# EasyEDA Pro project 密码存储器.eprj, board PCB2
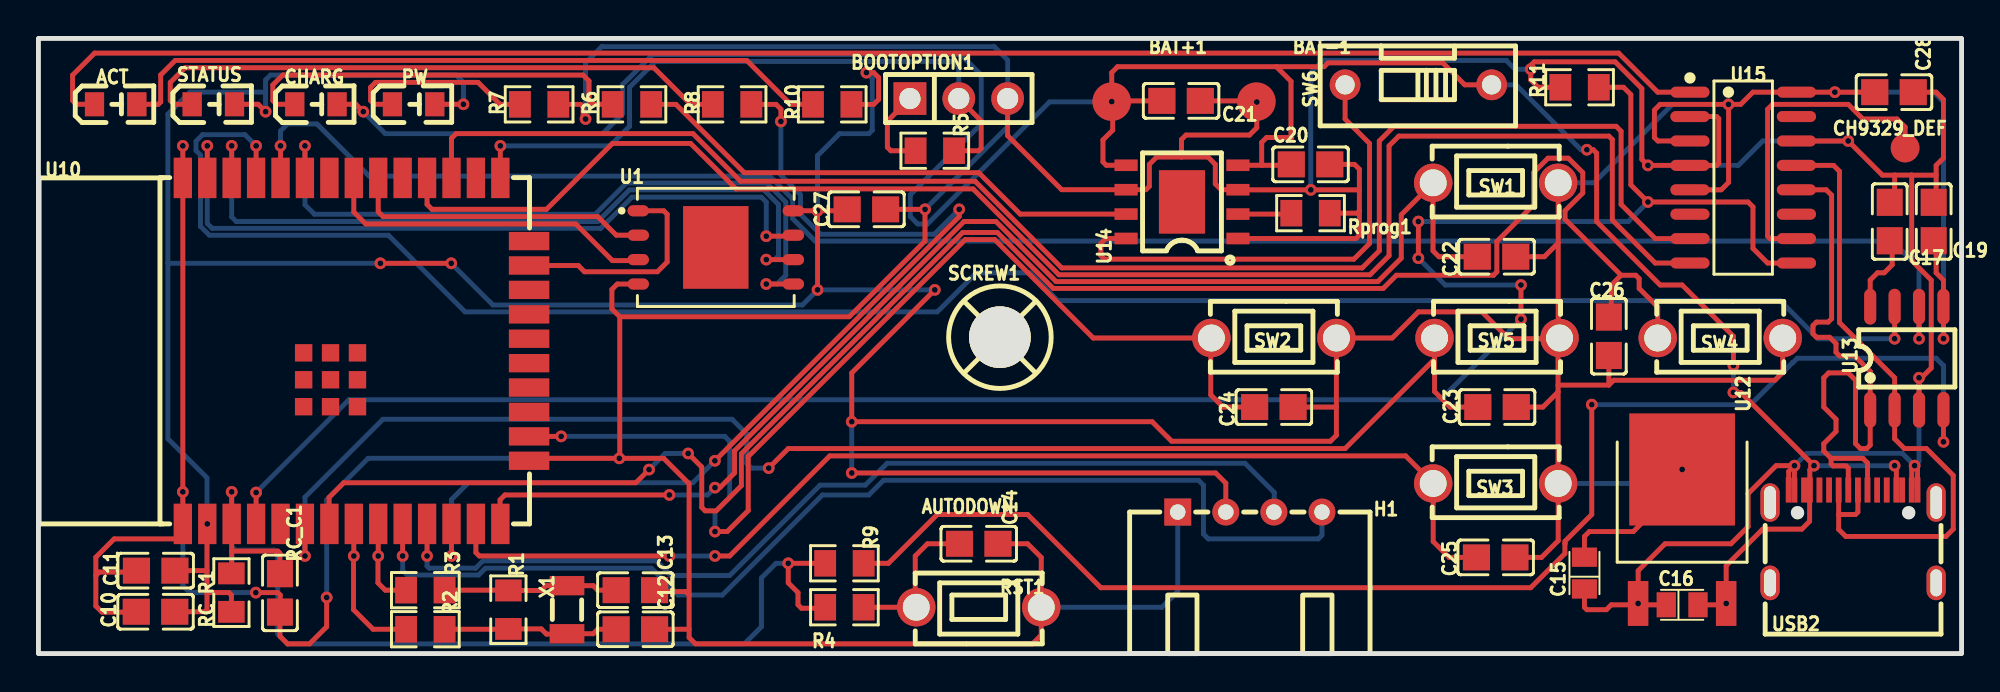
[diagram p4: board, top side]
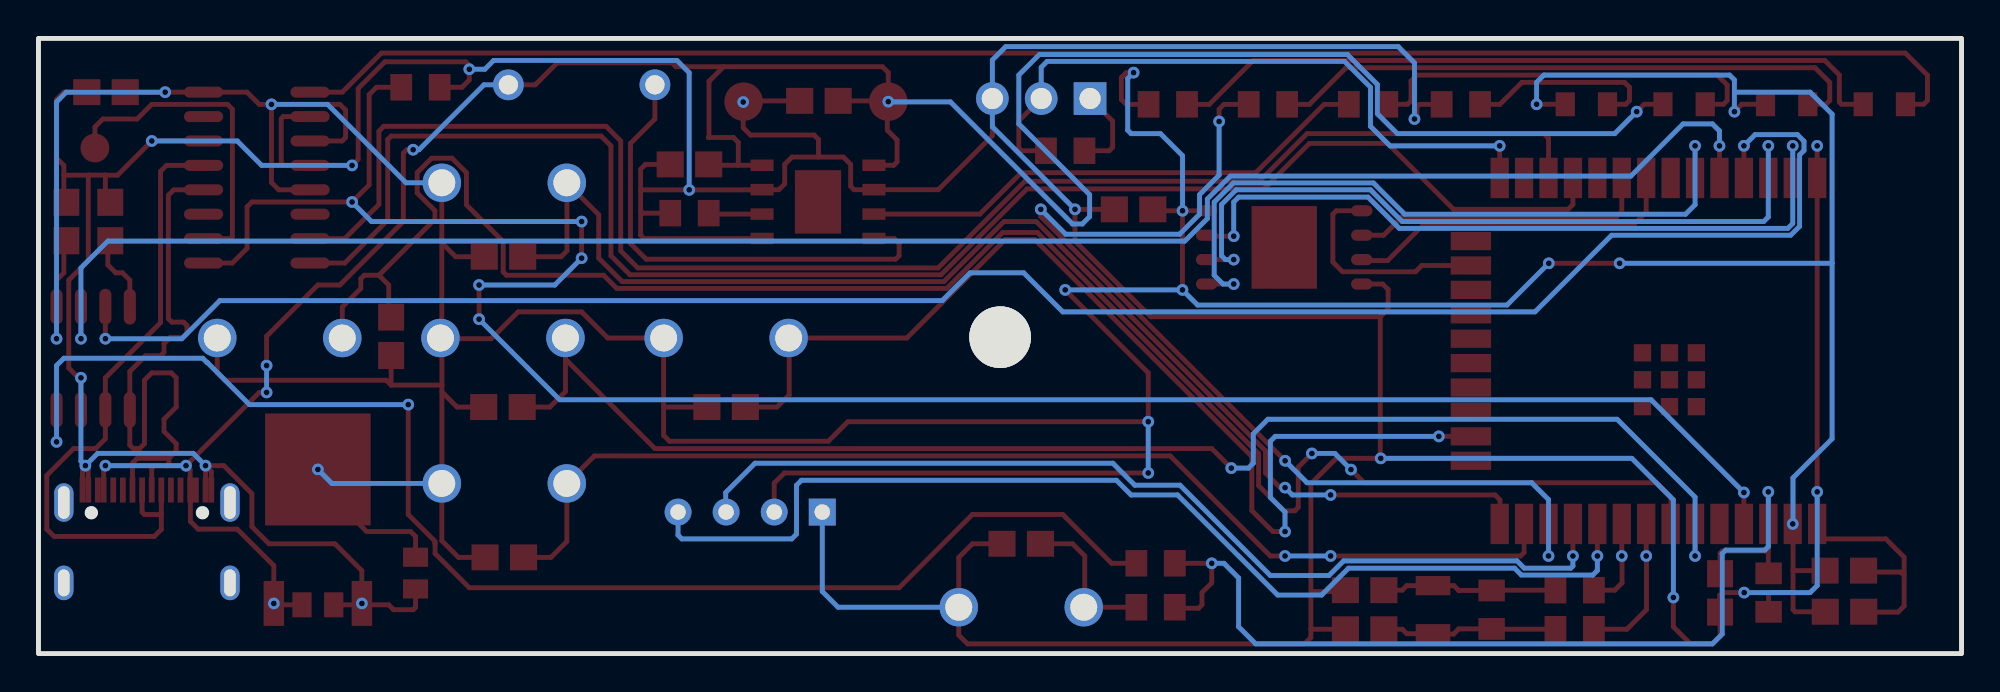
[diagram p5: board, bottom side, seen from below]

Outline 100 x 32 mm; copper layers: Top Layer, Bottom Layer. Coordinates in mm from the lower left corner of the outline.
Outline path: rectangle 0,32 100,0
Stack: Top Layer 0.035mm / Dielectric1 1.51mm FR4 er 4.5 / Bottom Layer 0.035mm

## Design rules (mm)
net UD+: DP1
net UD-: DP1
template: JLCPCB Capability(Two Layers Board)
spacing copperThickness1oz (default): track to track 0.102, other pairs 0.152 to 0.3
spacing copperThickness2oz: track to track 0.203, other pairs 0.152 to 0.3
track width copperThickness1oz (default): min 0.127, default 0.254, max 2.54
track width copperThickness2oz: min 0.203, default 0.254, max 2.54
differential pair differentialPair (default): width min 0.127, default 0.254, max 2.54; gap min 0.152, default 0.152
via viaSize (default): diameter min 0.5, default 0.61, max 10; hole min 0.3, default 0.305, max 6.3

## Placement (name value [footprint] x y rotation side)
ACT  -  [LED_0805]  4.06 28.57 0 top
BAT+1  -  [Test-Point-0.5mm]  55.81 28.71 90 top
BAT-1  -  [Test-Point-0.5mm]  63.33 28.71 90 top
BOOTOPTION1  PZ254V-11-03P  [HDR-TH_3P-P2.54-V-M]  47.86 28.87 0 top
C10  0.1uf  [C0805]  6.09 2.17 0 top
C11  22uf  [C0805]  6.1 4.31 0 top
C12  12pf  [C0805]  31.04 1.27 180 top
C13  12pf  [C0805]  31.04 3.3 180 top
C14  0.1uf  [C0805]  48.9 5.71 180 top
C15  10uF  [CAP-SMD_L2.1-W1.4-FD]  80.39 4.19 90 top
C16  22uF  [CAP-SMD_L2.1-W1.4-FD]  85.47 2.54 0 top
C17  0.1uf  [C0805]  96.27 22.47 90 top
C19  0.1uf  [C0805]  98.55 22.47 90 top
C20  10uf  [C0805]  66.15 25.45 0 top
C21  10uf  [C0805]  59.42 28.75 180 top
C22  0.1uf  [C0805]  75.82 20.64 0 top
C23  0.1uf  [C0805]  75.85 12.82 0 top
C24  0.1uf  [C0805]  64.24 12.82 0 top
C25  0.1uf  [C0805]  75.78 5 0 top
C26  0.1uf  [C0805]  81.66 16.51 270 top
C27  0.1uf  [C0805]  43.05 23.11 180 top
C28  0.1uf  [C0805]  96.49 29.21 180 top
CH9329_DEF  -  [Test-Point-0.5mm#2]  97.06 26.3 0 top
CHARG  -  [LED_0805]  14.48 28.57 0 top
H1  HCZZ0139-4  [CONN-TH_4P-P2.50_HCZZ0139-4]  62.99 7.36 0 top
PW  -  [LED_0805]  19.56 28.57 0 top
R1  7.5M  [R0805]  24.44 2.28 270 top
R2  0  [R0805]  20.12 1.27 180 top
R3  0  [R0805]  20.12 3.3 180 top
R4  0  [R0805]  41.91 2.41 180 top
R5  0  [R0805]  46.61 26.16 180 top
R6  10K  [R0805]  30.86 28.57 0 top
R7  10K  [R0805]  26.03 28.57 0 top
R8  10K  [R0805]  36.07 28.57 0 top
R9  0  [R0805]  41.91 4.7 0 top
R10  3.3K  [R0805]  41.28 28.57 180 top
R11  4.7K  [R0805]  80.14 29.46 0 top
RC_C1  1uf  [C0805]  12.56 3.16 90 top
RC_R1  10K  [R0805]  10.03 3.17 270 top
Rprog1  10K  [R0805]  66.15 22.91 180 top
RST1  ZX-QC36-4.3CJ  [KEY-TH_L6.0-W3.5-P6.50]  48.9 2.41 180 top
SCREW1  -  [M3螺丝]  50 16.46 0 top
STATUS  -  [LED_0805]  9.14 28.57 0 top
SW1  ZX-QC36-4.3CJ  [KEY-TH_L6.0-W3.5-P6.50]  75.78 24.49 0 top
SW2  ZX-QC36-4.3CJ  [KEY-TH_L6.0-W3.5-P6.50]  64.24 16.42 0 top
SW3  ZX-QC36-4.3CJ  [KEY-TH_L6.0-W3.5-P6.50]  75.78 8.85 0 top
SW4  ZX-QC36-4.3CJ  [KEY-TH_L6.0-W3.5-P6.50]  87.45 16.42 0 top
SW5  ZX-QC36-4.3CJ  [KEY-TH_L6.0-W3.5-P6.50]  75.85 16.42 0 top
SW6  Chager  [SW-TH_DSWB01LHGET]  71.75 29.59 270 top
U1  W25N01GVZEIG  [WSON-8_L8.0-W6.10-P1.27-TL-EP]  35.22 21.13 0 top
U10  ESP32-WROOM-32E-N8  [WIFI-SMD_ESP32-WROOM-32E]  16.51 15.74 0 top
U12  AMS1117CD-3.3  [TO-252-2_L6.5-W6.1-P4.58-LS10.0-BR]  85.47 6.09 270 top
U13  CH340N  [SOP-8_L4.9-W3.9-P1.27-LS6.0-BL]  97.16 15.36 0 top
U14  TP4056-42-ESOP8  [ESOP-8_L4.9-W3.9-P1.27-LS6.0-BL-EP]  59.46 23.5 90 top
U15  CH9329  [SOP-16_L9.9-W3.9-P1.27-LS6.0-BL]  88.65 24.76 270 top
USB2  KH-TYPE-C-16P  [USB-C-SMD_KH-TYPE-C-16P]  94.36 6.09 0 top
X1  32.768kHz  [FC-135R_L3.2-W1.5]  27.48 2.28 270 top

## Footprints (pads in the part's own frame, mm; a bottom-side part is the same pattern mirrored in y, then rotated)
C0805
  rect 1.41x1.35 smd: 1(-1,0) 2(1,0)
CAP-SMD_L2.1-W1.4-FD
  rect 1x1.3 smd: 1(-0.825,0) 2(0.825,0)
CONN-TH_4P-P2.50_HCZZ0139-4
  rect 1.4x1.4 hole 0.8: 1(-3.75,0)
  round 1.4 hole 0.8: 2(-1.25,0) 3(1.25,0) 4(3.75,0)
ESOP-8_L4.9-W3.9-P1.27-LS6.0-BL-EP
  rect 0.6x1.2 smd: 1(-1.905,-2.909) 2(-0.635,-2.909) 3(0.635,-2.909) 4(1.905,-2.909) 5(1.905,2.909) 6(0.635,2.909) 7(-0.635,2.909) 8(-1.905,2.909)
  rect 3.3x2.4 smd: 9(0,0)
FC-135R_L3.2-W1.5
  rect 1x1.8 smd: 1(-1.25,0) 2(1.25,0)
HDR-TH_3P-P2.54-V-M
  rect 1.7x1.7 hole 1.1: 1(-2.54,0)
  round 1.7 hole 1.1: 2(0,0) 3(2.54,0)
KEY-TH_L6.0-W3.5-P6.50
  round 2 hole 1.4: 1(-3.25,0) 2(3.25,0)
LED_0805
  rect 1x1.25 smd: 1(-1.15,0.005) 2(1.05,0.005)
M3螺丝
  round 3.2 hole 3.2: 1(0,0)
R0805
  rect 1.133x1.377 smd: 1(-1,0) 2(1,0)
SOP-8_L4.9-W3.9-P1.27-LS6.0-BL
  oval 0.63x1.865 smd: 1(-1.905,-2.683) 2(-0.635,-2.683) 3(0.635,-2.683) 4(1.905,-2.683) 5(1.905,2.683) 6(0.635,2.683) 7(-0.635,2.683) 8(-1.905,2.683)
SOP-16_L9.9-W3.9-P1.27-LS6.0-BL
  oval 0.574x2.038 smd: 1(-4.445,-2.769) 2(-3.175,-2.769) 3(-1.905,-2.769) 4(-0.635,-2.769) 5(0.635,-2.769) 6(1.905,-2.769) 7(3.175,-2.769) 8(4.445,-2.769) 9(4.445,2.769) 10(3.175,2.769) 11(1.905,2.769) 12(0.635,2.769) 13(-0.635,2.769) 14(-1.905,2.769) 15(-3.175,2.769) 16(-4.445,2.769)
SW-TH_DSWB01LHGET
  round 1.6 hole 1: 1(0,3.81) 2(0,-3.81)
Test-Point-0.5mm
  round 2 smd: 1(0,0)
Test-Point-0.5mm#2
  round 1.5 smd: 1(0,0)
TO-252-2_L6.5-W6.1-P4.58-LS10.0-BR
  rect 2.336x1.064 smd: 1(3.486,-2.29) 3(3.486,2.29)
  rect 5.826x5.491 smd: 4(-3.486,0)
USB-C-SMD_KH-TYPE-C-16P
  oval 1x2 hole 0.6x1.7: 1(-4.32,1.765) 2(4.32,1.765)
  oval 1x1.8 hole 0.6x1.4: 3(-4.32,-2.415) 4(4.32,-2.415)
  rect 0.3x1.3 smd: A1(-3.35,2.415) A4(-2.55,2.415) A5(-1.25,2.415) A6(-0.25,2.415) A7(0.25,2.415) A8(1.25,2.415) A9(2.55,2.415) A12(3.35,2.415) B1(3.05,2.415) B4(2.25,2.415) B5(1.75,2.415) B6(0.75,2.415) B7(-0.75,2.415) B8(-1.75,2.415) B9(-2.25,2.415) B12(-3.05,2.415)
WIFI-SMD_ESP32-WROOM-32E
  rect 0.95x2.1 smd: 1(-9.002,-9) 2(-7.732,-9) 3(-6.463,-9) 4(-5.192,-9) 5(-3.922,-9) 6(-2.652,-9) 7(-1.383,-9) 8(-0.113,-9) 9(1.157,-9) 10(2.428,-9) 11(3.697,-9) 12(4.968,-9) 13(6.237,-9) 14(7.508,-9) 25(7.508,9) 26(6.237,9) 27(4.968,9) 28(3.697,9) 29(2.428,9) 30(1.157,9) 31(-0.113,9) 32(-1.383,9) 33(-2.652,9) 34(-3.922,9) 35(-5.192,9) 36(-6.463,9) 37(-7.732,9) 38(-9.002,9)
  rect 2.1x0.95 smd: 15(9.002,-5.715) 16(9.002,-4.445) 17(9.002,-3.175) 18(9.002,-1.905) 19(9.002,-0.635) 20(9.002,0.635) 21(9.002,1.905) 22(9.002,3.175) 23(9.002,4.445) 24(9.002,5.715)
  rect 0.9x0.9 smd: 39(-2.721,-0.1) 39(-2.721,-1.5) 39(-2.721,-2.9) 39(-1.321,-0.1) 39(-1.321,-1.5) 39(-1.321,-2.9) 39(0.079,-0.1) 39(0.079,-1.5) 39(0.079,-2.9)
WSON-8_L8.0-W6.10-P1.27-TL-EP
  oval 1.115x0.581 smd: 1(-4.033,1.905) 2(-4.033,0.635) 3(-4.033,-0.635) 4(-4.033,-1.905) 5(4.033,-1.905) 6(4.033,-0.635) 7(4.033,0.635) 8(4.033,1.905)
  rect 3.4x4.3 smd: 9(0,0)

## Nets
As in the schematic.

Pads without a net: SCREW1 1; U1 9; U10 5 17 18 19 20 21 22 32 39; U14 9; U15 6 11 15; USB2 1 2 3 4 A5 A8 B5 B8

## Via types
v1: diameter 0.61, hole 0.305, Top Layer to Bottom Layer, 78 vias

## Routing (per net, layer and track width the routed paths; a pad name or vN(x,y) marks a point on that pad's centre or on a via; arc(x,y) is an arc through that point)
GND: length 357.2
  Top Layer w0.254: 96.52,23.47 96.52,24.89 ; 96.52,24.89 96.52,24.89 97.41,24.89 97.41,24.89 ; 96.52,24.89 95.88,24.89 v1(94.11,26.67) U15.14 ; C21.1 63.29,28.75 BAT-1.1 v1(63.35,28.69) 63.35,27.36 62.97,26.97 59.67,26.97 59.44,26.74 59.44,25.83 ; U14.1 68.51,21.59 68.69,21.77 68.69,23.04 ; 59.44,25.83 58.15,25.83 57.77,25.45 57.77,24.31 57.59,24.13 U14.6 53.21,24.13 50.4,26.94 BOOTOPTION1.3 ; 59.44,25.83 60.81,25.83 61.19,25.45 61.19,24.43 61.5,24.13 U14.3 62.38,24.12 v1(66.16,24.12) 68.69,24.12 ; 97.41,24.89 98.68,24.89 ; 97.41,24.89 97.41,20.44 98.43,19.43 98.43,14.86 97.92,14.35 v1(97.79,14.35) U13.3 ; 98.68,24.89 98.68,25.4 99.06,25.78 99.06,28.83 98.68,29.21 97.74,29.21 ; 98.68,24.89 98.68,23.47 ; 33.83,3.04 33.83,8.83 32.51,10.16 30.33,10.16 30.23,10.05 30.23,17.52 ; 33.83,3.04 33.83,1.27 ; 33.83,3.04 33.66,3.22 32.11,3.22 C13.1 ; 97.71,8.51 97.71,9.63 v1(97.56,9.78) 97.41,9.63 USB2.B1 ; 50.02,5.71 51.44,5.71 52.15,5 RST1.1 52.15,0.96 51.69,0.5 34.16,0.5 33.83,0.83 33.83,1.27 ; 30.23,17.52 29.82,17.93 29.82,18.94 30.1,19.22 U1.4 ; 30.23,17.52 42.16,17.52 46.1,21.46 v1(46.1,23.11) C27.1 ; v1(83.18,2.61) 83.11,2.54 81.79,2.54 81.53,2.28 80.52,2.28 80.39,2.41 C15.1 ; v1(83.18,2.61) 83.25,2.54 C16.1 ; v1(83.18,2.61) 83.19,2.61 83.19,4.31 84.58,5.71 88.01,5.71 88.9,6.6 88.9,8.32 90.36,9.78 91.31,9.78 91.31,9.77 ; 2.98,4.06 2.98,2.47 3.3,2.16 5.07,2.16 C10.1 ; 2.98,4.06 3.16,4.24 5.02,4.24 C11.1 ; 2.98,4.06 2.98,5.01 3.94,5.97 7.51,5.97 U10.1 v1(7.51,8.41) U10.38 v1(7.51,26.41) ; 68.69,24.12 68.69,23.04 ; 68.69,24.12 68.69,25.2 68.43,25.45 C20.2 ; 91.31,9.77 v1(91.31,9.78) ; 91.31,9.77 91.01,9.47 USB2.A1 ; 91.31,9.77 91.31,8.51 ; 33.83,1.27 C12.1 ; 68.69,23.04 68.56,22.91 Rprog1.1 ; v1(14.99,2.92) 14.99,1.39 14.1,0.5 12.95,0.5 12.56,0.9 RC_C1.1 12.57,2.17 12.57,3.04 12.45,3.17 v1(11.3,3.17) ; U15.2 87.27,27.94 87.38,27.83 87.38,25.5 87.27,25.4 U15.4 v1(83.69,25.4) 83.38,25.71 83.38,29.4 81.99,30.78 77.78,30.78 77.6,30.6 77.6,29.84 77.98,29.46 R11.1 ; v1(28.45,27.81) 28.32,27.94 28.32,28.44 28.19,28.57 R7.2 ; U10.15 25.64,10.16 v1(30.2,10.16)
  Bottom Layer w0.254: v1(66.16,24.12) 66.16,30.22 66.8,30.86 76.33,30.86 76.79,30.4 v1(77.6,30.4) ; H1.1 59.24,3.23 58.42,2.41 RST1.1 ; v1(30.2,10.16) 17.14,10.16 14.99,8 v1(14.99,2.92) ; v1(94.11,26.67) 89.66,26.67 88.39,25.4 v1(83.69,25.4) ; v1(91.31,9.78) 91.95,10.41 96.92,10.41 v1(97.56,9.78) 97.79,10 v1(97.79,14.35) ; v1(7.51,8.41) 7.51,3.54 7.87,3.17 v1(11.3,3.17) ; v1(46.1,23.11) 50.4,27.41 BOOTOPTION1.3 50.4,30.88 49.7,31.57 29.29,31.57 28.45,30.73 v1(28.45,27.81)
VCC: length 144.2
  Top Layer w0.254: v1(16.89,28.19) 16.5,28.58 CHARG.2 ; v1(88.14,14.98) 88.14,16.51 85.47,19.17 84.33,19.17 81.03,22.47 81.03,26.03 80.85,26.21 v1(80.52,26.21) ; v1(55.81,28.71) 55.81,30.22 56.12,30.53 64.37,30.53 ; v1(55.81,28.71) 55.85,28.75 C21.2 ; v1(55.81,28.71) 55.86,28.66 55.86,27.23 55.35,26.72 55.35,25.58 55.53,25.4 U14.5 ; 63.62,25.4 U14.4 ; 63.62,25.4 65.1,25.4 C20.1 ; 63.62,25.4 63.61,25.41 63.61,26.59 63.86,26.85 65.17,26.85 65.13,26.88 65.13,29.77 64.37,30.53 ; v1(96.52,9.78) 96.61,9.68 USB2.B4 ; 64.37,30.53 66.86,30.53 67.06,30.73 73.03,30.73 74.17,29.59 SW6.1 ; C16.2 87.69,2.54 v1(87.76,2.61) 87.76,4.57 89.66,6.47 91.69,6.47 92.1,6.88 92.1,8.5 USB2.B9 92.11,9.56 v1(92.33,9.78) 88.52,13.58 v1(88.14,13.58)
  Bottom Layer w0.254: SW6.1 76.84,29.59 80.21,26.21 v1(80.52,26.21) ; v1(16.89,28.19) 18.03,27.05 29.34,27.05 30.38,28.09 30.38,29.61 31.93,31.16 47.96,31.16 49.02,30.09 49.02,27.56 45.34,23.87 45.34,22.73 45.72,22.35 46.23,22.35 52.58,28.7 55.8,28.7 v1(55.81,28.71) ; v1(88.14,13.58) v1(88.14,14.98) ; v1(92.33,9.78) v1(96.52,9.78)
VDD33: length 305.2
  Top Layer w0.254: C26.2 81.66,13.97 ; 81.66,13.97 81.91,14.22 90.3,14.22 90.7,14.62 SW4.2 ; 81.66,13.97 79.03,13.97 79.02,13.95 ; 8.76,4.31 7.22,4.31 ; 8.76,4.31 8.76,3.17 ; 8.76,4.31 8.76,5.89 8.78,5.91 v1(8.78,6.74) ; C23.2 78.23,12.82 79.02,13.61 ; 8.76,3.17 9.91,3.17 10.03,3.04 RC_R1.2 ; 8.76,3.17 8.76,2.28 8.66,2.17 7.21,2.17 ; 67.49,12.82 C24.2 ; 67.49,12.82 SW2.2 70.4,16.42 71.75,17.78 75.06,17.78 76.45,16.38 79.06,16.38 ; 67.49,12.82 67.49,11.35 67.18,11.05 58.93,11.05 57.91,12.06 v1(42.29,12.06) 42.29,14.6 v1(46.61,18.92) ; v1(99.06,16.38) U13.5 99.06,19.43 98.68,19.81 98.68,21.47 ; v1(43.05,30.22) 43.43,30.22 43.69,29.97 43.69,28.83 43.43,28.57 R10.1 ; v1(87.88,28.57) 87.88,24.51 87.5,24.13 U15.5 ; v1(87.88,28.57) 84.33,28.57 84.03,28.27 84.03,26.85 84.21,26.67 U15.3 ; v1(87.88,28.57) 88.52,28.57 89.15,29.21 U15.16 v1(93.41,29.21) 95.74,29.21 ; C25.2 78.16,5 79.03,5.87 SW3.2 79.02,8.86 79.02,13.61 ; v1(40.51,23.03) 39.25,23.03 ; v1(40.51,23.03) 40.51,23.03 v1(40.51,18.92) ; v1(40.51,23.03) 42,23.03 42.05,22.98 ; 79.02,13.61 79.02,13.95 ; 79.02,13.95 79.02,16.34 79.06,16.38 ; C15.2 80.39,6.09 80.65,6.35 82.93,6.35 85.47,8.89 v1(85.47,9.58) ; v1(11.81,28.19) 11.42,28.58 STATUS.2 ; 79.03,21.36 79.03,16.49 SW5.2 79.06,16.38 ; 79.03,21.36 78.31,20.64 C22.2 ; 79.03,21.36 SW1.2 ; v1(42.29,9.39) 61.21,9.39 61.74,8.87 H1.2 ; PW.2 v1(22.1,28.58) ; v1(17.78,20.3) v1(21.46,20.3)
  Bottom Layer w0.254: SW1.2 80.88,24.49 84.96,28.57 v1(87.88,28.57) ; v1(42.29,9.39) v1(42.29,12.06) ; 6.73,20.3 6.73,11.17 8.76,9.14 8.76,6.73 ; 6.73,20.3 v1(17.78,20.3) ; 6.73,20.3 6.73,28.06 7.87,29.21 11.81,29.21 ; v1(11.81,28.19) 11.81,29.21 ; 11.81,29.21 11.81,29.84 12.06,30.09 21.72,30.09 22.1,29.71 v1(22.1,28.58) ; v1(85.47,9.58) 84.74,8.85 SW3.2 ; v1(21.46,20.3) 23.63,18.13 39.73,18.13 v1(40.51,18.92) v1(46.61,18.92) ; 93.47,29.21 98.55,29.21 99.06,28.7 v1(99.06,16.38) ; v1(43.05,30.22) 43.36,29.92 43.36,27.23 43.18,27.05 41.66,27.05 40.51,25.9 v1(40.51,23.03)
ESP32_EN: length 53.2
  Top Layer w0.254: RC_R1.1 10.05,4.19 10.05,5.33 ; R9.1 v1(38.99,4.7) 38.99,3.68 39.5,3.17 39.5,2.54 39.68,2.36 40.86,2.36 R4.2 ; v1(10.05,8.41) U10.3 10.05,5.33 ; 10.05,5.33 10.05,5.33 12.45,5.33 12.56,5.22 RC_C1.2
  Bottom Layer w0.254: v1(38.99,4.7) 38.35,4.7 37.59,3.93 37.59,1.39 36.7,0.5 12.95,0.5 12.45,1.01 12.45,5.2 12.27,5.38 10.23,5.38 10.05,5.56 v1(10.05,8.41)
IIC_SCL: length 50.8
  Top Layer w0.254: U10.11 v1(20.21,5.08)
  Bottom Layer w0.254: H1.3 64.26,7.38 64.26,8.38 62.74,9.9 44.13,9.9 42.99,8.76 40.64,8.76 35.94,4.06 32.89,4.06 32.13,4.82 23.12,4.82 22.74,4.44 20.32,4.44 20.21,4.55 v1(20.21,5.08)
IIC_SDA: length 57.6
  Top Layer w0.254: U10.10 v1(18.94,5.08)
  Bottom Layer w0.254: v1(18.94,5.08) 18.94,4.32 19.18,4.08 22.89,4.08 23.24,4.44 31.88,4.44 33.27,3.04 35.56,3.04 40.77,8.25 43.18,8.25 43.94,9.01 60.32,9.01 60.58,8.76 60.58,6.22 60.83,5.97 66.55,5.97 66.74,6.16 H1.4
IO0: length 34.8
  Top Layer w0.254: BOOTOPTION1.2 49.02,27.71 49.02,26.28 48.9,26.16 R5.1 ; U10.25 v1(24.02,26.41)
  Bottom Layer w0.254: v1(24.02,26.41) 29.72,26.41 30.73,27.43 30.73,29.46 32.08,30.81 47.55,30.81 47.86,30.5 BOOTOPTION1.2
IO0_USE: length 4.6
  Top Layer w0.254: R5.2 44.32,26.16 44.14,26.34 44.14,27.7 BOOTOPTION1.1
IO12: length 67.2
  Top Layer w0.254: 72.52,24.48 SW1.1 ; 72.52,24.48 72.52,20.95 72.82,20.64 C22.1 ; 72.52,24.48 70.87,22.83 70.87,20.57 69.65,19.35 52.92,19.35 49.79,22.47 48.12,22.47 36.19,10.55 36.19,9.39 35.43,8.63 v1(35.18,8.63) ; v1(32.81,8.25) 24.26,8.25 24,8 24,6.76 U10.14
  Bottom Layer w0.254: v1(35.18,8.63) 34.8,8.25 v1(32.81,8.25)
IO13: length 56.9
  Top Layer w0.254: C24.1 61.59,12.82 60.96,13.46 60.96,16.39 SW2.1 54.84,16.42 49.72,21.54 48.19,21.54 36.91,10.25 36.91,7.44 35.81,6.35 v1(35.18,6.35) ; U10.16 v1(27.18,11.3)
  Bottom Layer w0.254: v1(27.18,11.3) 35.69,11.3 35.94,11.05 35.94,8.12 35.18,7.36 v1(35.18,6.35)
IO14: length 59.6
  Top Layer w0.254: U10.13 22.75,5.26 22.93,5.08 v1(32.81,5.08) ; v1(35.18,5.08) 35.94,5.08 41.15,10.28 71.09,10.28 SW3.1 72.53,5.83 73.35,5 C25.1
  Bottom Layer w0.254: v1(35.18,5.08) 32.89,5.08
IO15: length 11.6
  Top Layer w0.254: U10.23 28.07,20.19 28.39,19.86 32.19,19.86 32.69,20.37 32.69,22.85 32.51,23.03 U1.1
IO16: length 80.5
  Top Layer w0.254: U15.7 84.07,21.59 82.3,23.36 82.3,27.17 82.04,27.43 70.49,27.43 69.72,26.67 69.72,20.95 68.83,20.06 53.21,20.06 48.7,24.57 36.51,24.57 34.04,27.05 21.72,27.05 21.48,26.81 U10.27
IO17: length 82.9
  Top Layer w0.254: U10.28 20.21,23.36 20.46,23.11 26.42,23.11 29.84,26.54 33.91,26.54 36.28,24.17 48.6,24.17 53.07,19.71 69.24,19.71 70.23,20.7 70.23,26.41 70.74,26.92 81.66,26.92 81.84,26.74 81.84,22.55 84.07,20.32 U15.8
IO18: length 15.8
  Top Layer w0.254: U10.30 17.67,22.98 17.92,22.73 29.08,22.73 30.05,21.76 U1.2
IO19: length 17.6
  Top Layer w0.254: U10.31 16.4,22.97 17.02,22.35 27.94,22.35 29.84,20.44 31.14,20.44 U1.3
IO21: length 37.4
  Top Layer w0.254: 39.25,19.22 v1(37.85,19.22) ; U10.33 v1(13.86,26.41)
  Bottom Layer w0.254: v1(13.86,26.41) 13.86,23.35 14.35,22.86 28.96,22.86 30.58,24.48 37.86,24.48 38.86,23.48 38.86,19.68 38.41,19.22 v1(37.85,19.22)
IO22: length 39.7
  Top Layer w0.254: 39.25,20.49 v1(37.85,20.49) ; U10.36 v1(10.05,26.41)
  Bottom Layer w0.254: v1(37.85,20.49) 38.28,20.49 38.48,20.7 38.48,23.36 37.71,24.13 30.73,24.13 29.08,22.47 10.29,22.47 10.05,22.71 v1(10.05,26.41)
IO23: length 38.9
  Top Layer w0.254: U10.37 v1(8.78,26.41) ; 39.25,21.76 39.2,21.71 v1(37.85,21.71)
  Bottom Layer w0.254: v1(8.78,26.41) 8.78,22.37 9.03,22.12 29.24,22.12 30.86,23.75 37.59,23.75 37.85,23.49 v1(37.85,21.71)
IO27: length 54.2
  Top Layer w0.254: v1(38.61,27.68) 38.61,28.32 38.35,28.57 R8.2 ; v1(47.88,23.11) 47.88,22.73 v1(35.17,10.03) ; U10.12 v1(21.48,5.08)
  Bottom Layer w0.254: v1(38.61,27.68) 38.61,24.89 39.62,23.87 39.62,22.86 40.66,21.81 46.58,21.81 v1(47.88,23.11) ; v1(21.48,5.08) 21.48,8.01 22.35,8.89 34.03,8.89 v1(35.17,10.03)
IO32: length 7.6
  Top Layer w0.254: U10.8 v1(16.4,5.08) 16.38,5.06 16.38,2.28 17.4,1.27 R2.2
IO33: length 4.7
  Top Layer w0.254: U10.9 v1(17.67,5.08) 17.65,5.06 17.65,3.68 18.03,3.3 R3.2
IO34: length 74.8
  Top Layer w0.254: U10.6 v1(13.86,5.08) ; 72.6,15.32 SW5.1 ; 72.6,15.32 67.94,10.66 38.99,10.66 v1(37.97,9.65) ; 72.6,15.32 72.6,13.63 73.41,12.82 C23.1
  Bottom Layer w0.254: v1(13.86,5.08) 13.86,8.14 17.91,12.19 36.07,12.19 36.83,11.43 36.83,9.9 37.08,9.65 v1(37.97,9.65)
IO35: length 97.1
  Top Layer w0.254: 82.3,19.68 79.38,22.59 79.38,23.04 80.31,23.96 80.31,25.02 79.56,25.77 78.5,25.77 77.75,25.02 77.75,23.35 75.84,21.43 75.84,19.85 75.66,19.68 70.61,19.68 69.93,18.99 52.77,18.99 49.86,21.9 48.06,21.9 36.55,10.4 36.55,8.73 35.24,7.43 34.67,7.43 34.49,7.61 34.49,9.7 v1(33.78,10.41) ; 82.3,19.68 81.79,19.17 81.79,17.63 C26.1 ; 82.3,19.68 83.06,19.68 83.24,19.5 83.24,18.99 84.2,18.03 84.2,16.42 ; U10.7 15.11,6.76 15.11,8.12 15.88,8.89 31.06,8.89 v1(31.75,9.57)
  Bottom Layer w0.254: v1(33.78,10.41) 32.59,10.41 v1(31.75,9.57)
IO36: length 111.2
  Top Layer w0.254: v1(71.75,22.47) v1(71.75,20.57) ; v1(77.09,19.17) v1(77.09,17.39) ; U10.4 v1(11.32,8.38) ; U15.9 89.92,20.32 89.15,21.08 89.15,23.24 88.9,23.49 v1(83.69,23.49) 82.8,24.38 82.8,29.08 82.42,29.46 R11.2
  Bottom Layer w0.254: v1(77.09,19.17) 73.15,19.17 v1(71.75,20.57) ; v1(11.32,8.38) 16.14,13.2 72.9,13.2 v1(77.09,17.39) ; v1(83.69,23.49) 82.68,22.47 v1(71.75,22.47)
RXD0: length 96.9
  Top Layer w0.254: U13.6 v1(97.79,16.38) ; U10.34 v1(12.59,26.41)
  Bottom Layer w0.254: v1(97.79,16.38) 97.79,20.06 96.39,21.46 40.39,21.46 39.22,22.63 39.22,23.64 38.02,24.84 17.19,24.84 14.48,27.56 12.95,27.56 12.59,27.19 v1(12.59,26.41)
TP4056_CE: length 25.2
  Top Layer w0.254: SW6.2 67.94,27.81 69.22,26.54 69.22,21.33 68.4,20.52 55.42,20.52 55.25,20.7 55.25,21.33 55.5,21.59 U14.8
TXD0: length 103.6
  Top Layer w0.254: U10.35 v1(11.32,26.41) ; U13.7 v1(96.52,16.38)
  Bottom Layer w0.254: v1(11.32,26.41) 10.73,27 8.54,27 8.19,26.65 8.19,26.17 8.42,25.94 8.42,22.23 8.88,21.76 18.2,21.76 22.18,17.78 46.74,17.78 48.77,19.81 51.56,19.81 53,18.36 90.57,18.36 92.55,16.38 v1(96.52,16.38)
UD+: length 34.7
  Top Layer w0.254: USB2.B6 95.11,9.91 94.87,10.16 93.22,10.16 ; 93.22,10.16 92.84,10.54 92.84,10.92 93.47,11.55 93.47,12.19 92.84,12.82 92.84,14.35 93.09,14.6 94.11,14.6 94.49,14.22 94.49,10.92 94.74,10.66 95.07,10.66 95.25,10.84 U13.1 95.25,14.68 94.44,15.49 93.65,15.49 93.47,15.67 93.47,16.12 93.14,16.45 92.46,16.45 92.28,16.63 92.28,17.06 92.46,17.24 93.07,17.24 93.25,17.42 93.25,23.84 92.96,24.13 U15.12 ; 93.22,10.16 93.22,9.86 93.32,9.76 94,9.76 94.11,9.65 USB2.A6
UD-: length 34.6
  Top Layer w0.254: 93.61,7.23 94.49,7.23 94.61,7.36 USB2.A7 ; 93.61,7.23 USB2.B7 ; 93.61,7.23 93.61,6.46 93.98,6.09 99.19,6.09 99.57,6.47 99.57,9.27 98.17,10.66 97.03,10.66 96.52,11.17 U13.2 96.52,14.35 93.65,17.22 93.65,25.09 93.34,25.4 U15.13
$1N2842: length 8.1
  Top Layer w0.254: R4.1 RST1.2 45.59,2.46 45.59,5.08 46.23,5.71 48.02,5.71
$1N2858: length 27.1
  Top Layer w0.254: U14.7 51.05,22.86 48.9,25.02 36.7,25.02 33.15,28.57 R6.2
$1N2859: length 21.2
  Top Layer w0.254: CHARG.1 12.38,28.58 12.19,28.77 12.19,29.58 12.7,30.09 28.32,30.09 28.63,29.79 28.63,28.76 28.81,28.58 29.86,28.58 R6.1
$1N2862: length 2.8
  Top Layer w0.254: U14.2 65.1,22.86 Rprog1.2
$1N2886: length 73.2
  Top Layer w0.254: R9.2 44.2,4.7 46.74,7.23 51.44,7.23 55.25,3.42 77.6,3.42 79.38,5.2 79.38,5.72 79.38,5.72 79.38,5.84 80.77,7.23 v1(80.77,12.95) ; U13.4 v1(99.06,11.01)
  Bottom Layer w0.254: v1(80.77,12.95) 89.03,12.95 91.21,15.14 91.23,15.14 91.46,15.36 98.68,15.36 99.06,14.98 v1(99.06,11.01)
$1N2889: length 4.3
  Top Layer w0.254: U13.8 95.25,19.43 95.63,19.81 95.98,19.81 96.39,20.22 96.39,21.47 96.16,21.47
$1N2903: length 9.1
  Top Layer w0.254: C12.2 29.08,1.27 28.85,1.03 X1.2 27.46,1.01 26.42,1.01 26.15,1.28 R1.2 24.42,1.27 R2.1
$1N2904: length 9.1
  Top Layer w0.254: C13.2 29.08,3.3 28.85,3.53 X1.1 26.4,3.53 26.15,3.28 R1.1 24.42,3.3 R3.1
$1N2982: length 10.3
  Top Layer w0.254: PW.1 17.46,28.58 17.27,28.77 17.27,29.45 17.53,29.71 22.86,29.71 24,28.57 R7.1
$1N2983: length 31.5
  Top Layer w0.254: STATUS.1 7.05,28.58 6.85,28.77 6.85,29.71 7.62,30.48 32,30.48 33.91,28.57 R8.1
$1N3524: length 88
  Top Layer w0.254: ACT.1 1.97,28.58 1.77,28.77 1.77,30.09 2.92,31.24 82.17,31.24 84.2,29.21 U15.1
$1N3550: length 37.9
  Top Layer w0.254: ACT.2 6.23,28.58 6.36,28.7 6.36,30.1 7.11,30.86 36.83,30.86 39.12,28.57 R10.2
$1N3609: length 17
  Top Layer w0.254: U15.10 90.04,21.59 89.92,21.71 89.92,28.32 90.17,28.57 94.11,28.57 94.87,27.81 96.65,27.81 97.06,27.39 CH9329_DEF.1

Small or netless copper shapes (teardrops, artwork), in the pictures only: 1 on Top Layer

## Text on the board
Top Silkscreen Layer: AUTODOWN
